# Altium schematic sheet LCL_pin_bias.SchDoc
size A3; Organization: Altium Limited; Address1: L3, 12a Rodborough Rd; Address2: Frenchs Forest; Address3: NSW; Address4: Australia 2086
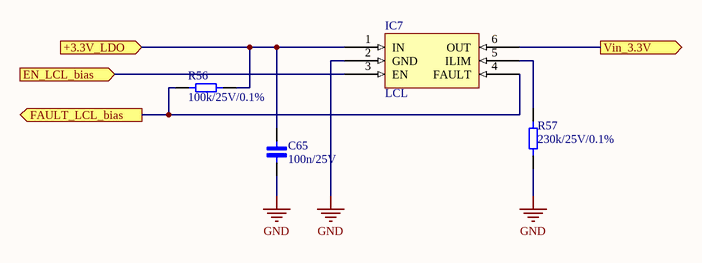
[diagram p0: LCL_pin_bias.SchDoc]

## Parts
C65  100n/25V  [Cap_0402]
IC7  LCL  [SOT-23-6]
R56  100k/25V/0.1%  [RES_0402]
R57  230k/25V/0.1%  [RES_0402]

## Ports
+3.3V_LDO (in), EN_LCL_bias (in), FAULT_LCL_bias (out), Vin_3.3V (out)

## Nets
GND: C65.1 IC7.2(GND) R57.1
+3.3V_LDO: C65.2 IC7.1(IN) R56.1 ; port +3.3V_LDO
EN_LCL_bias: IC7.3(EN) ; port EN_LCL_bias
FAULT_LCL_bias: IC7.4(FAULT) R56.2 ; port FAULT_LCL_bias
Vin_3.3V: IC7.6(OUT) ; port Vin_3.3V
NetIC7_5: IC7.5(ILIM) R57.2

## Notes on the sheet
- Title
- Size:
- Date:
- A3
- Number:
- Time:
- Revision:
- Sheet
- of
- File:

## Library data of the parts
C65 = Cap_0402_100n: Ceramic Capacitor 100n / 0402 / 25V / ±5%, Wurth Elektronik MLCC; ComponentLink1Description: New link; ComponentLink1URL: https://www.we-online.com/catalog/en/WCAP-CSGP-25VDC
IC7 = TPS2553: Latch-off Current Limiter; ComponentLink1Description: New link; ComponentLink1URL: https://www.ti.com/lit/ds/symlink/tps2553.pdf?ts=1603819295065&ref_url=https%253A%252F%252Fwww.google.com%252F
R56 = Res_0402_100k: Vishay, thin film resistor 100k/25V/0.1%
R57 = Res_0402_230k: Vishay, thin film resistor 230k/25V/0.1%